# Altium schematic sheet Sheet1.SchDoc
size A4
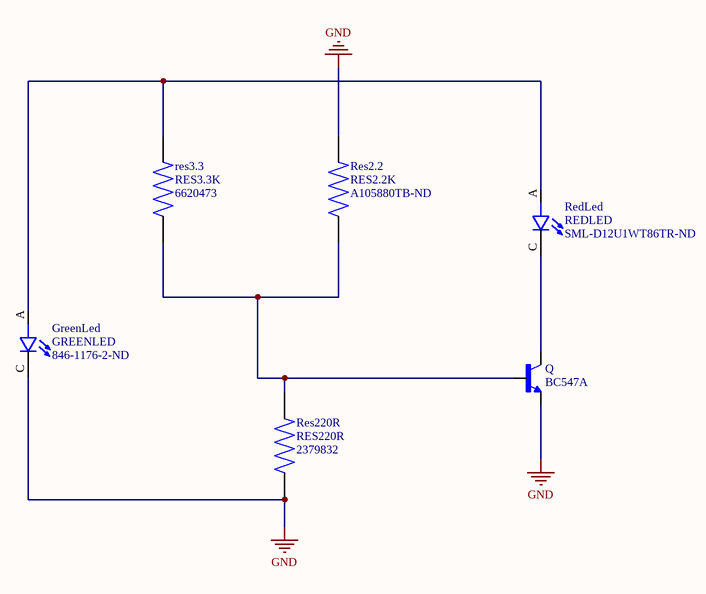
[diagram p0: Sheet1.SchDoc]

## Parts
GreenLed  GREENLED  Supplier Part Number 1: 846-1176-2-ND  [LED_GREEN]
Q  BC547A  [BC547B]
RedLed  REDLED  Supplier Part Number 1: SML-D12U1WT86TR-ND  [LED_RED]
Res2.2  RES2.2K  Supplier Part Number 1: A105880TB-ND  [RES2.2K]
res3.3  RES3.3K  Supplier Part Number 1: 6620473  [RES_3.3K]
Res220R  RES220R  Supplier Part Number 1: 2379832  [RES_220R]

## Nets
GND: GreenLed.C Q.3(E) Res2.2.2 Res220R.1
NetGreenLed_A: GreenLed.A RedLed.A res3.3.2
NetQ_1: Q.1(C) RedLed.C
NetQ_2: Q.2(B) Res2.2.1 res3.3.1 Res220R.2

## Library data of the parts
GreenLed = GREENLED: Green 565nm LED Indication - Discrete 2.2V 0603 (1608 Metric); MF: Rohm; MP: SML-D12FWT86; Check_prices: https://www.snapeda.com/parts/SML-D12FWT86/Rohm/view-part/2753923/?ref=eda; Package: 0603 Rohm; Price: None; Value: *; SnapEDA_Link: https://www.snapeda.com/parts/SML-D12FWT86/Rohm/view-part/2753923/?ref=snap; Availability: Good; Purchase-URL: https://pricing.snapeda.com/search/part/SML-D12FWT86/?ref=eda; Supplier 1: Digi-Key
Q = BC547A: Bipolar _BJT_ Transistor NPN 45V 100mA 300MHz 500mW Through Hole TO-92-3; MF: ON Semiconductor; Value: *; MP: BC547A; Package: TO-92 NXP Semiconductors; SnapEDA_Link: https://www.snapeda.com/parts/BC547A/ON%20Semiconductor/view-part/805861/?ref=snap; Price: None; Availability: Unavailable
RedLed = REDLED: Red 620nm LED Indication - Discrete 2.2V 0603 _1608 Metric_; MP: SML-D12U1WT86; MF: Rohm; Package: 0603 Rohm; Price: None; Availability: Unavailable; SnapEDA_Link: https://www.snapeda.com/parts/SML-D12U1WT86/Rohm/view-part/481503/?ref=snap; Value: *; Supplier 1: Digi-Key
Res2.2 = RES2.2K: RES 2.2K OHM 0.1% 1/8W 0805; MF: Panasonic; MP: ERA-6APB222V; Value: *; Check_prices: https://www.snapeda.com/parts/ERA-6APB222V/Panasonic/view-part/3718729/?ref=eda; Availability: In Stock; Package: 2012-2 Panasonic; SnapEDA_Link: https://www.snapeda.com/parts/ERA-6APB222V/Panasonic/view-part/3718729/?ref=snap; Price: None; Supplier 1: Digi-Key
res3.3 = RES3.3K: RES 3.3K OHM 0.1% 1/8W 0805; MF: Panasonic; MP: ERA6ARB332V; Value: *; Check_prices: https://www.snapeda.com/parts/ERA6ARB332V/Panasonic/view-part/5767158/?ref=eda; Availability: In Stock; Package: 2012-2 Panasonic; SnapEDA_Link: https://www.snapeda.com/parts/ERA6ARB332V/Panasonic/view-part/5767158/?ref=snap; Price: None; Supplier 1: RSComponents
Res220R = RES220R: MP: ERJ-2RHD2200X; Package: None; Price: None; Value: *; Availability: Unavailable; Supplier 1: Farnell